# Altium project Udemy_Project.PrjPcb
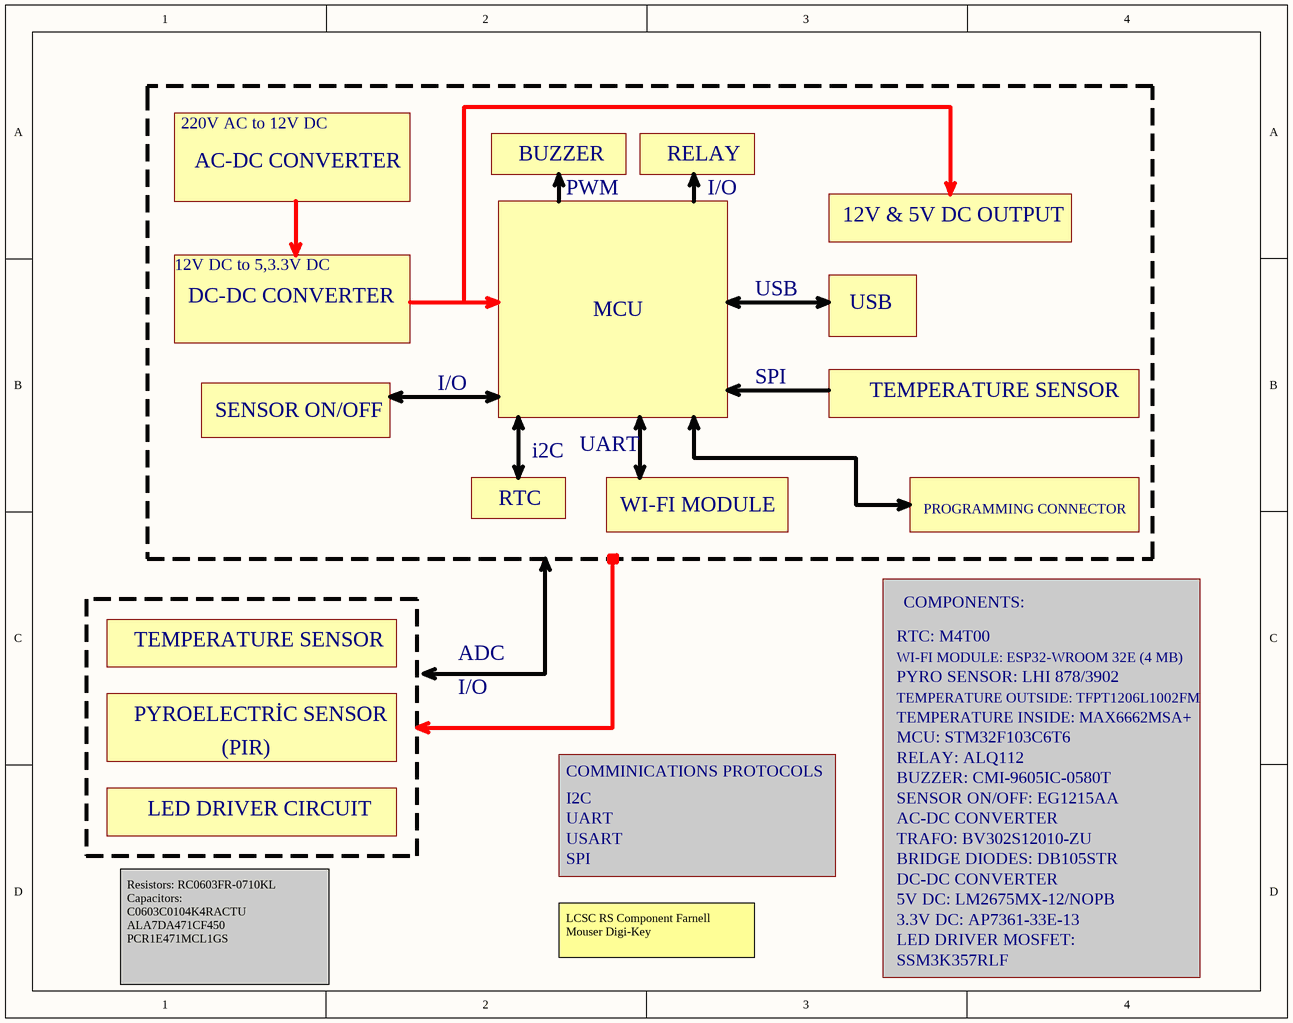
[diagram p0: Block Diagram.SchDoc]
5 sheets, 127 parts. Net scope: global (net labels, ports and power ports of the same name join across sheets).
Board file: Udemy_Project.PcbDoc
Sheets:
  Cover.SchDoc
  Block Diagram.SchDoc
  Power Management.SchDoc
  Microcontroller.SchDoc
  Sensor Board.SchDoc

## Sheet Cover.SchDoc: Wireless Security Dedector
size A; SheetNumber: 1; SheetTotal: 5

## Sheet Block Diagram.SchDoc
size A; Engineer: Cengizhan Kahraman; SheetNumber: 2; SheetTotal: 5

### Notes on the sheet
- 220V AC to 12V DC
- BUZZER
- RELAY
- AC-DC CONVERTER
- PWM
- I/O
- 12V & 5V DC OUTPUT
- 12V DC to 5,3.3V DC
- USB
- DC-DC CONVERTER
- MCU
- SENSOR ON/OFF
- SPI
- TEMPERATURE SENSOR
- RTC
- i2C
- UART
- WI-FI MODULE
- PROGRAMMING CONNECTOR
- RTC: M4T00
- COMPONENTS:
- ADC
- WI-FI MODULE: ESP32-WROOM 32E (4 MB)
- PYRO SENSOR: LHI 878/3902
- TEMPERATURE OUTSIDE: TFPT1206L1002FM
- PYROELECTRİC SENSOR
- (PIR)
- COMMINICATIONS PROTOCOLS
- TEMPERATURE INSIDE: MAX6662MSA+
- MCU: STM32F103C6T6
- RELAY: ALQ112
- LED DRIVER CIRCUIT
- I2C
- BUZZER: CMI-9605IC-0580T
- SENSOR ON/OFF: EG1215AA
- USART
- TRAFO: BV302S12010-ZU
- BRIDGE DIODES: DB105STR
- 5V DC: LM2675MX-12/NOPB
- LCSC RS Component Farnell Mouser Digi-Key
- LED DRIVER MOSFET:
- SSM3K357RLF
- 3.3V DC: AP7361-33E-13
- Resistors: RC0603FR-0710KL
  Capacitors:
  C0603C0104K4RACTU
  ALA7DA471CF450
  PCR1E471MCL1GS

## Sheet Power Management.SchDoc
size A3; SheetNumber: 3; SheetTotal: 5
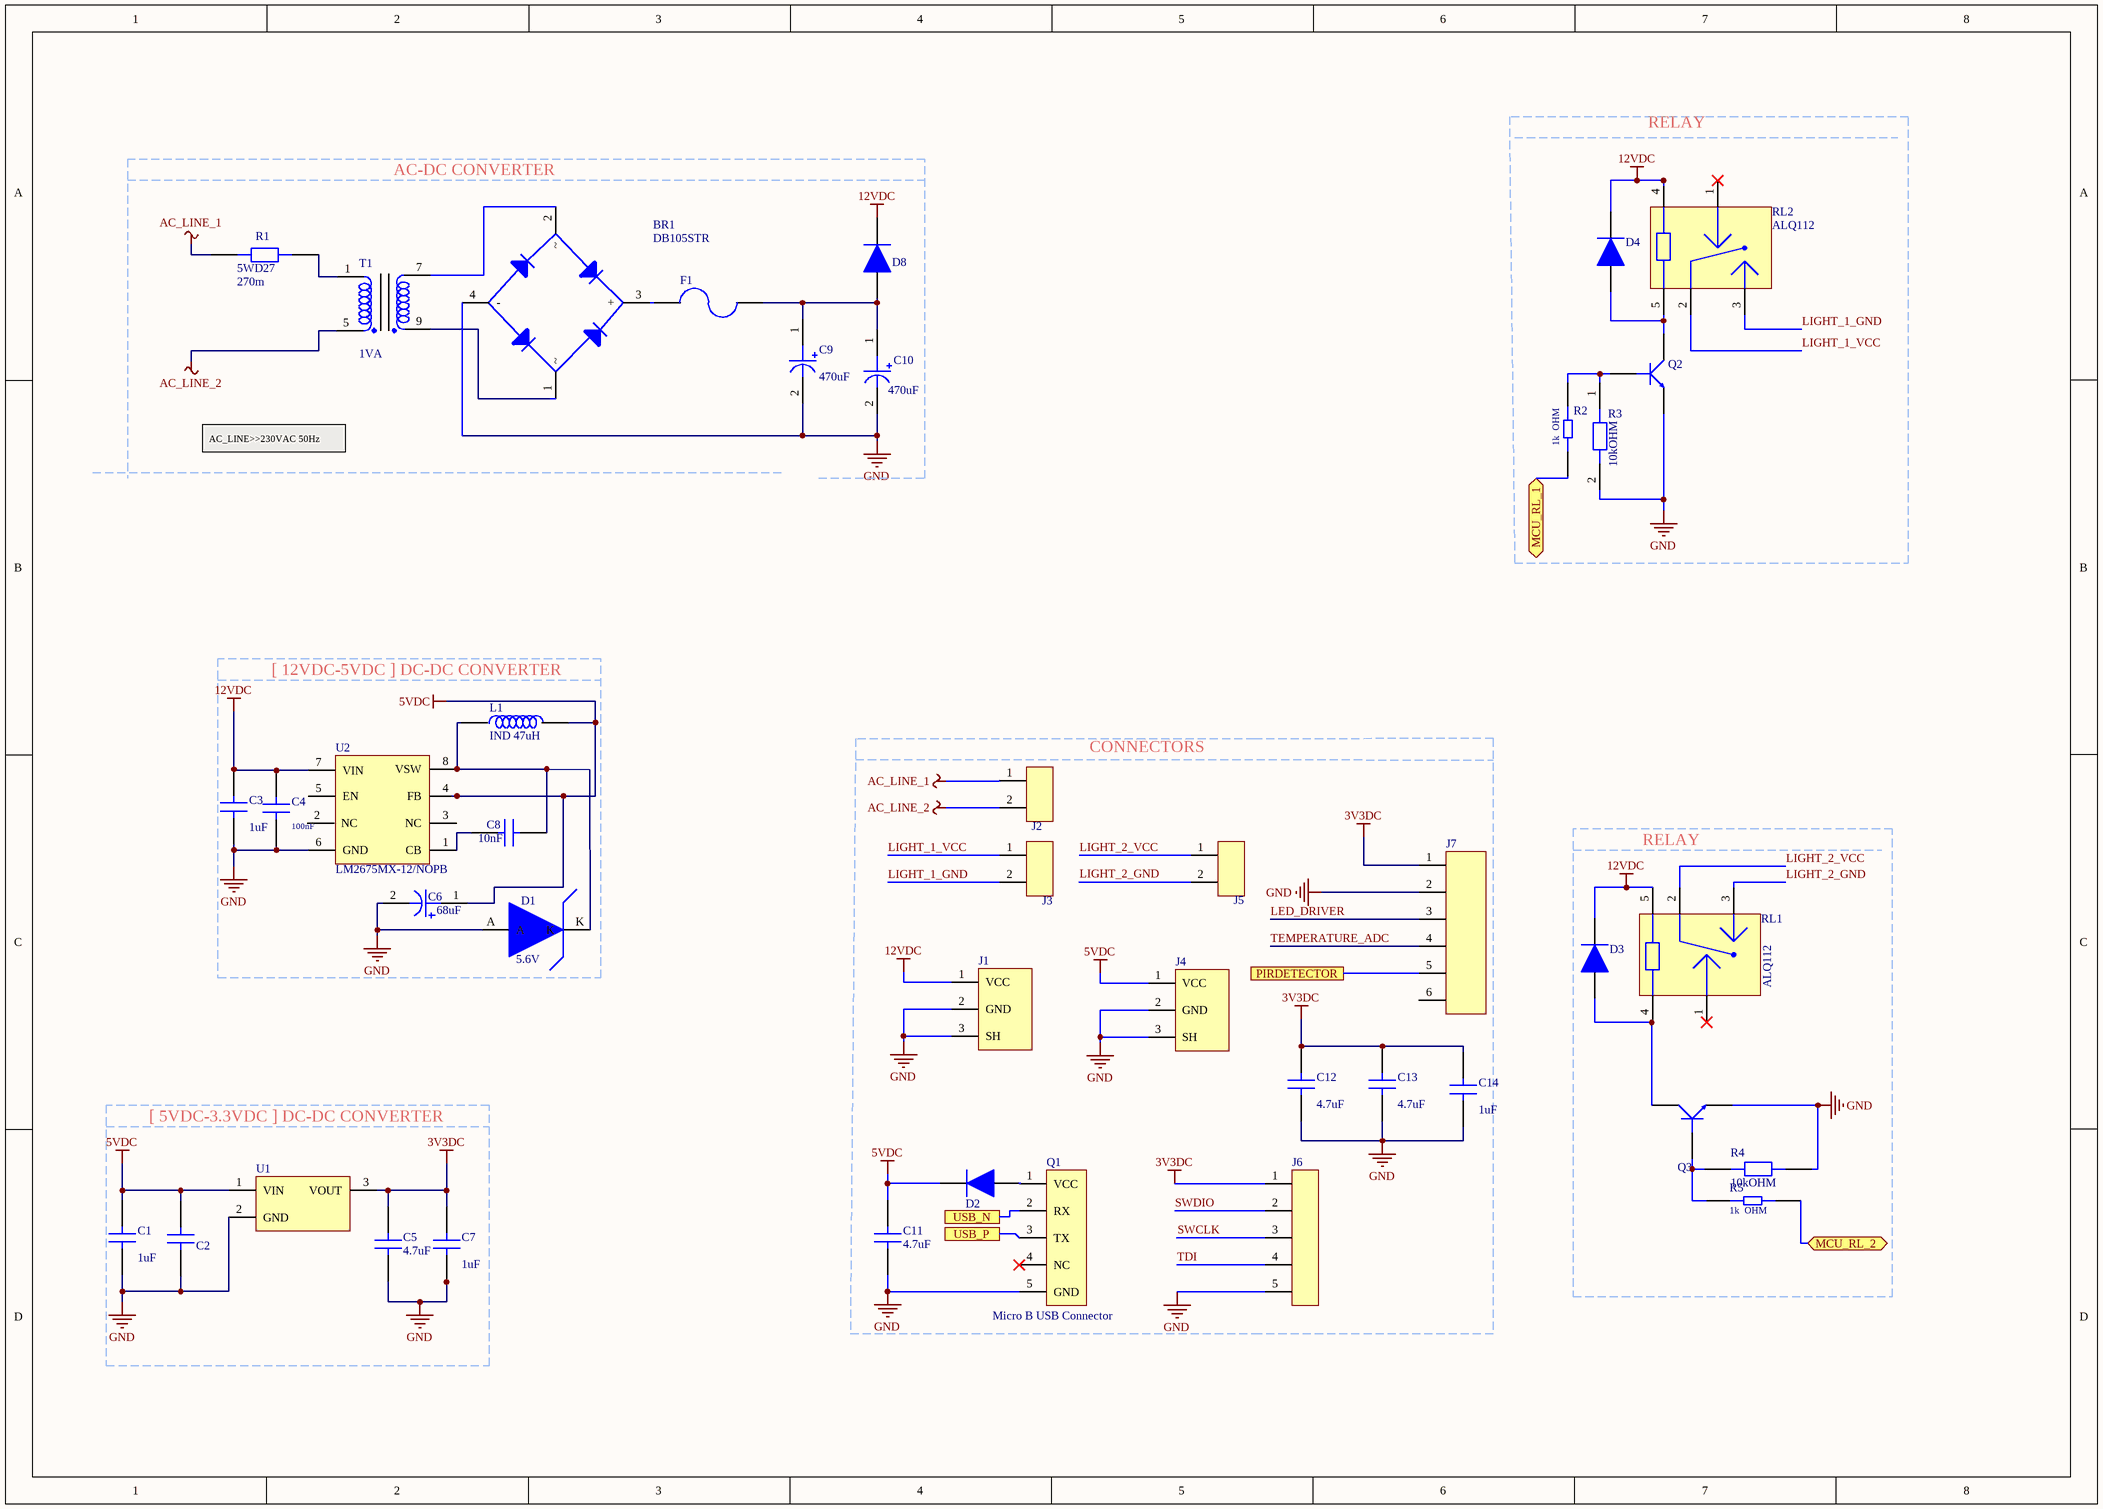
[diagram p1: Power Management.SchDoc]

### Parts
BR1  DB105STR  [DB1]
C1  Cap: 1uF  [CAP 0805]  (hidden comment: CAP CER 1uF)
C2  CAP CER 100nF 0603  [CAP_0603]  (value not drawn)
C3  Cap: 1uF  [CAP 0805]  (hidden comment: CAP CER 1uF)
C4  Capacitance: 100nF  [CAP 0805]  (hidden comment: CAP CER 100nF 0805)
C5  Cap: 4.7uF  [CAP 0805]  (hidden comment: CAP CER 4.7uF 0805)
C6  Capacitance: 68uF  [CAP EEVSERIES]  (hidden comment: CAP ALU 68uF)
C7  Cap: 1uF  [CAP 0805]  (hidden comment: CAP CER 1uF)
C8  Capacitance: 10nF  [CAP_0603]  (hidden comment: CAP CER 10nF 0603)
C9  Cap: 470uF  [CAP_RADIAL_D10_P5]  (hidden comment: ESH477M050AH4AA)
C10  Cap: 470uF  [CAP_RADIAL_D10_P5]  (hidden comment: ESH477M050AH4AA)
C11  Cap: 4.7uF  [CAP 0805]  (hidden comment: CAP CER 4.7uF 0805)
C12  Cap: 4.7uF  [CAP 0805]  (hidden comment: CAP CER 4.7uF 0805)
C13  Cap: 4.7uF  [CAP 0805]  (hidden comment: CAP CER 4.7uF 0805)
C14  Cap: 1uF  [CAP 0805]  (hidden comment: CAP CER 1uF)
D1  Zener Voltage: 5.6V  [SZM]  (hidden comment: SZMMSZ52)
D2  1N4148WS  [SOD323F]  (value not drawn)
D3  1N4148WS  [SOD323F]  (value not drawn)
D4  1N4148WS  [SOD323F]  (value not drawn)
D8  1N4148WS  [SOD323F]  (value not drawn)
F1  FUSE 3413.0216.22  [FUSE 3413.0216.22]  (value not drawn)
J1  PJ-037AH-SMT-TR  [JACk]  (value not drawn)
J2  TBP01R1-508-02BE  [TBP01R1-508]  (value not drawn)
J3  TBP01R1-508-02BE  [TBP01R1-508]  (value not drawn)
J4  PJ-037AH-SMT-TR  [JACk]  (value not drawn)
J5  TBP01R1-508-02BE  [TBP01R1-508]  (value not drawn)
J6  SMH-105-02-L-S  [PINHEADER1X5_RA]  (value not drawn)
J7  64800611622_conn_6pin  [64800611622]  (value not drawn)
L1  IND 47uH  [IND_1212]
Q1  Micro B USB Connector  [MICRO_B_USB]
Q2  MMBT3904-7-F  [SOT-23F]  (value not drawn)
Q3  MMBT3904-7-F  [SOT-23F]  (value not drawn)
R1  5WD27  Resistance: 270m  [RES_AXIAL_W]
R2  Reisitance: 1k  OHM  [RES_0603]  (hidden comment: RES 1K OHM 0603)
R3  Resistance: 10kOHM  [RES_0603]  (hidden comment: RES 10K OHM 0603)
R4  Resistance: 10kOHM  [RES_0603]  (hidden comment: RES 10K OHM 0603)
R5  Reisitance: 1k  OHM  [RES_0603]  (hidden comment: RES 1K OHM 0603)
RL1  ALQ112  [ALQ112]
RL2  ALQ112  [ALQ112]
T1  Rated Power: 1VA  [BV302S]  (hidden comment: BV302S12010-ZU)
U1  AP7361-33E-13  [SOT223]  (value not drawn)
U2  LM2675MX-12/NOPB  [SOIC8]

### Blocks framed on the sheet
RELAY: D4 Q2 R2 R3 RL2
[ 12VDC-5VDC ] DC-DC CONVERTER: C3 C4 C6 C8 D1 L1 U2
CONNECTORS: C11-C14 D2 J1-J7 Q1
RELAY: D3 Q3 R4 R5 RL1
[ 5VDC-3.3VDC ] DC-DC CONVERTER: C1 C2 C5 C7 U1

### Ports
MCU_RL_1 (bidir, see Microcontroller[6800,6750]), MCU_RL_2 (bidir, see Microcontroller[6809.449,6650]), PIRDETECTOR (see Microcontroller[6600,6350]), USB_N (see Microcontroller[7000,8850]), USB_P (see Microcontroller[6900,7750])

### Nets
3V3DC: C5.1 C7.2 C12.2 C13.2 C14.2 J6.1 J7.1 U1.3(VOUT)
5VDC: C1.2 C2.2 C6.1 C11.1 D2.1 J4.1(VCC) L1.2 U1.1(VIN) U2.4(FB)
12VDC: C3.1 C4.2 D3.1 D4.1 D8.1 J1.1(VCC) RL1.5 RL2.4 U2.7(VIN)
AC_LINE_1: J2.1 R1.1
AC_LINE_2: J2.2 T1.5
GND: BR1.4(-) C1.1 C2.1 C3.2 C4.1 C5.2 C6.2 C7.1 C9.2 C10.2 C11.2 C12.1 C13.1 C14.1 D1.A J1.2(GND) J1.3(SH) J4.2(GND) J4.3(SH) J6.5 J7.2 Q1.5(GND) Q2.2(E) Q3.2(E) R3.2 R4.1 U1.2(GND) U2.6(GND)
LED_DRIVER: J7.3
LIGHT_1_GND: J3.2 RL2.3
LIGHT_1_VCC: J3.1 RL2.2
LIGHT_2_GND: J5.2 RL1.3
LIGHT_2_VCC: J5.1 RL1.2
SWCLK: J6.3
SWDIO: J6.2
TDI: J6.4
TEMPERATURE_ADC: J7.4
USB_N: Q1.2(RX) ; port USB_N
USB_P: Q1.3(TX) ; port USB_P
NetBR1_1: BR1.1 T1.9
NetBR1_2: BR1.2 T1.7
NetBR1_3: BR1.3(+) F1.1
NetC8_1: C8.1 U2.1(CB)
NetC8_2: C8.2 D1.K L1.1 U2.8(VSW)
NetC9_1: C9.1 C10.1 D8.2 F1.2
NetD2_2: D2.2 Q1.1(VCC)
NetD3_2: D3.2 Q3.3(C) RL1.4
NetD4_2: D4.2 Q2.3(C) RL2.5
NetJ7_5: J7.5 ; port PIRDETECTOR
NetQ2_1: Q2.1(B) R2.2 R3.1
NetQ3_1: Q3.1(B) R4.2 R5.2
NetR1_2: R1.2 T1.1
NetR2_1: R2.1 ; port MCU_RL_1
NetR5_1: R5.1 ; port MCU_RL_2

Not connected (* = marked no-connect by the designer): J7 6; Q1 4(NC)*; RL1 1*; RL2 1*; U2 2(NC) 3(NC) 5(EN)

### Notes on the sheet
- (near BR1) AC-DC CONVERTER
- AC_LINE>>230VAC 50Hz
- Programing
  Connection

### Library data of the parts
BR1 = DB105STR: Bridge Rect 1PHASE 600V 1A Db-s; Manufacturer: SMC; Supplier 1: Future Electronics; Manufacturer Part Number: DB105STR; RoHS: No; Category: Industrial Control; Pricing 1: 1500=0.0744, 4500=0.0716, 15000=0.0686, 30000=0.067, 60000=0.064 (USD); Mount: Surface Mount; Case/Package: SMD/SMT; Min Operating Temperature: -55°C; Max Operating Temperature: 150°C; Packaging: Tape and Reel; Average Rectified Current: 1A; ComponentLink1URL: http://www.smc-diodes.com/propdf/DB101S%20THRU%20DB107S%20N1459%20REV.B.pdf?src-supplier=Digi-Key; ComponentLink1Description: http://www.smc-diodes.com/propdf/DB101S%20THRU%20DB107S%20N1459%20REV.B.pdf?src-supplier=Digi-Key; Supplier Part Number 1: 5119461; Case/Packag: *
C4 = CAP CER 100nF 0805: Multilayer Ceramic Capacitor, VJ Series, 0.1 - F, - 10%, X7R, 50 V, 0805 [2012 Metric]; Manufacturer: Vishay Vitramon; Manufacturer Part Number: VJ0805Y104KNAAT; Voltage Rating (DC): 50V; Supplier 1: Farnell; RoHS: Yes; Category: Ceramic Capacitors; Pricing 1: 5=0.523, 50=0.312, 250=0.297, 500=0.214, 1500=0.201, 3000=0.17, 15000=0.15, 30000=0.147 (EUR); Mount: Surface Mount; Case/Package: 0805; Case Code (Metric): 2012; Case Code (Imperial): 0805; Min Operating Temperature: -55°C; Max Operating Temperature: 125°C; Tolerance: 10%; Dielectric: X7R; Packaging: Tape and Reel; Termination: SMD/SMT; Series: VJ; Package Quantity: 1; Construction: Flat; Voltage Rating: 50V; Voltage: 50V; Length: 2mm; Width: 0.049inch; Height: 1.45mm; Depth: 1.25mm; Thickness: 0.057inch; Radiation Hardening: No; RoHS Compliant: Yes; Reach SVHC Compliant: Unknown; ComponentLink1URL: https://datasheet.ciiva.com/11785/0900766b8104796c-11785977.pdf?src-supplier=Rs; ComponentLink1Description: https://datasheet.ciiva.com/11785/0900766b8104796c-11785977.pdf?src-supplier=Rs; ComponentLink2URL: https://datasheet.ciiva.com/46417/1805046-46417861.pdf?src-supplier=Element14; ComponentLink2Description: https://datasheet.ciiva.com/46417/1805046-46417861.pdf?src-supplier=Element14; ComponentLink3URL: https://datasheet.ciiva.com/46417/1805046-46417862.pdf?src-supplier=Element14; ComponentLink3Description: https://datasheet.ciiva.com/46417/1805046-46417862.pdf?src-supplier=Element14; ComponentLink4URL: https://datasheet.ciiva.com/148/nonmagneticepoxybond-148471.pdf?src-supplier=Digi-Key; ComponentLink4Description: https://datasheet.ciiva.com/148/nonmagneticepoxybond-148471.pdf?src-supplier=Digi-Key; ComponentLink5URL: https://datasheet.ciiva.com/148/nonmagneticepoxybond-148472.pdf?src-supplier=Digi-Key; ComponentLink5Description: https://datasheet.ciiva.com/148/nonmagneticepoxybond-148472.pdf?src-supplier=Digi-Key; ComponentLink6URL: https://datasheet.ciiva.com/148/nonmagneticepoxybond-148473.pdf?src-supplier=Digi-Key; ComponentLink6Description: https://datasheet.ciiva.com/148/nonmagneticepoxybond-148473.pdf?src-supplier=Digi-Key; Supplier Part Number 1: 2407330
C5 C11-C13 = CAP CER 4.7uF 0805: CAP CER 4.7UF 25V X5R 0805; Manufacturer: Samsung; Manufacturer Part Number: CL21A475KAQNNNE; Supplier 1: Arrow Electronics; RoHS: Yes; Category: Ceramic Capacitors; Stock 1: 906000; Pricing 1: 2000=0.0173, 4000=0.0169, 10000=0.0146, 14000=0.0133, 50000=0.0114, 100000=0.0096, 200000=0.0089 (USD); ComponentLink1URL: https://datasheet.ciiva.com/25798/cl21a475kaqnnne-25798882.pdf?src-supplier=Digi-Key; ComponentLink1Description: https://datasheet.ciiva.com/25798/cl21a475kaqnnne-25798882.pdf?src-supplier=Digi-Key; Supplier Part Number 1: CL21A475KAQNNNE
C9 C10 = ESH477M050AH4AA: Cap, 470UF, 50V, Alu Elec, Radial; Manufacturer: KEMET; Supplier 1: Mouser; Manufacturer Part Number: ESH477M050AH4AA; RoHS: Yes; Stock 1: 3823; Pricing 1: 1=0.57, 10=0.4, 50=0.302, 100=0.263, 1000=0.263, 10000=0.263 (USD); ComponentLink1URL: https://api.kemet.com/component-edge/download/datasheet/ESH477M050AH4AA.pdf?src-supplier=Digi-Key; ComponentLink1Description: https://api.kemet.com/component-edge/download/datasheet/ESH477M050AH4AA.pdf?src-supplier=Digi-Key; ComponentLink2URL: https://datasheet.octopart.com/ESH477M050AH4AA-KEMET-datasheet-130075338.pdf?src-supplier=Newark; ComponentLink2Description: https://datasheet.octopart.com/ESH477M050AH4AA-KEMET-datasheet-130075338.pdf?src-supplier=Newark; Supplier Part Number 1: 80-ESH477M050AH4AA
D1 = SZMMSZ52: Diode Zener Single 16V 5% 500mW Automotive 2-Pin SOD-123 T/R; Manufacturer: ON Semiconductor; Manufacturer Part Number: SZMMSZ5246BT1G; Supplier 1: Arrow Electronics; RoHS: Yes; Category: Zener Diodes; Stock 1: 14410; Pricing 1: 1=0.3412, 10=0.2585, 25=0.2552, 100=0.1485, 250=0.1467, 500=0.0977, 1000=0.0743, 3000=0.0616, 6000=0.0574 (USD); ComponentLink1URL: https://datasheet.ciiva.com/10638/mmsz5221bt1-d-10638284.pdf?src-supplier=Avnet; ComponentLink1Description: https://datasheet.ciiva.com/10638/mmsz5221bt1-d-10638284.pdf?src-supplier=Avnet; ComponentLink2URL: https://datasheet.ciiva.com/900/mmsz5221bt1-d-900242.pdf?src-supplier=Digi-Key; ComponentLink2Description: https://datasheet.ciiva.com/900/mmsz5221bt1-d-900242.pdf?src-supplier=Digi-Key; Supplier Part Number 1: SZMMSZ5246BT1G
D2-D4 D8 = 1N4148WS: VR=75V IF=150mA Trr=4ns P=200mW; Manufacturer: ON Semiconductor / Fairchild; Supplier 1: Future Electronics; Manufacturer Part Number: 1N4148WS; RoHS: Yes; Category: Rectifier Diodes; Stock 1: 423000; Pricing 1: 3000=0.0191, 12000=0.0183, 45000=0.0175, 75000=0.0173, 150000=0.0164 (USD); ComponentLink1URL: https://datasheet.ciiva.com/30479/0900766b810e1cd3-30479206.pdf?src-supplier=Rs; ComponentLink1Description: https://datasheet.ciiva.com/30479/0900766b810e1cd3-30479206.pdf?src-supplier=Rs; ComponentLink2URL: https://datasheet.ciiva.com/8300/1n914bws-8300360.pdf?src-supplier=Avnet; ComponentLink2Description: https://datasheet.ciiva.com/8300/1n914bws-8300360.pdf?src-supplier=Avnet; ComponentLink3URL: https://datasheet.ciiva.com/15208/getdatasheetpartid-127819-15208358.pdf?src-supplier=Verical; ComponentLink3Description: https://datasheet.ciiva.com/15208/getdatasheetpartid-127819-15208358.pdf?src-supplier=Verical; ComponentLink4URL: https://datasheet.ciiva.com/910/1n4148ws-910380.pdf?src-supplier=Digi-Key; ComponentLink4Description: https://datasheet.ciiva.com/910/1n4148ws-910380.pdf?src-supplier=Digi-Key; ComponentLink5URL: https://datasheet.ciiva.com/910/1n4148ws-910381.pdf?src-supplier=Digi-Key; ComponentLink5Description: https://datasheet.ciiva.com/910/1n4148ws-910381.pdf?src-supplier=Digi-Key; ComponentLink6URL: https://datasheet.ciiva.com/910/1n4148ws-910382.pdf?src-supplier=Digi-Key; ComponentLink6Description: https://datasheet.ciiva.com/910/1n4148ws-910382.pdf?src-supplier=Digi-Key; Supplier Part Number 1: 8814485
F1 = FUSE 3413.0216.22: Fuse Chip Fast Acting 1A 32V SMD Solder Pad 1206 Glass T/R VDE/cULus; Manufacturer: Schurter; Supplier 1: Avnet; Manufacturer Part Number: 3413.0216.22; RoHS: Yes; Category: Fuses; Stock 1: 2000; Pricing 1: 1000=0.37339, 2000=0.3654, 4000=0.35496, 6000=0.34713, 8000=0.33408, 10000=0.32625, 100000=0.31842 (USD); ComponentLink1URL: https://datasheet.ciiva.com/301/typ-usi-1206-301440.pdf?src-supplier=Digi-Key; ComponentLink1Description: https://datasheet.ciiva.com/301/typ-usi-1206-301440.pdf?src-supplier=Digi-Key; ComponentLink2URL: https://datasheet.ciiva.com/14102/qousi1206-data-e-14102903.pdf?src-supplier=Distrelec; ComponentLink2Description: https://datasheet.ciiva.com/14102/qousi1206-data-e-14102903.pdf?src-supplier=Distrelec; ComponentLink3URL: https://datasheet.ciiva.com/16316/typ-usi-1206-16316588.pdf?src-supplier=Future+Electronics; ComponentLink3Description: https://datasheet.ciiva.com/16316/typ-usi-1206-16316588.pdf?src-supplier=Future+Electronics; ComponentLink4URL: https://datasheet.ciiva.com/301/typ-usi-1206-301439.pdf?src-supplier=Digi-Key; ComponentLink4Description: https://datasheet.ciiva.com/301/typ-usi-1206-301439.pdf?src-supplier=Digi-Key; ComponentLink5URL: https://datasheet.ciiva.com/301/typ-usi-1206-301441.pdf?src-supplier=Digi-Key; ComponentLink5Description: https://datasheet.ciiva.com/301/typ-usi-1206-301441.pdf?src-supplier=Digi-Key; ComponentLink6URL: https://datasheet.ciiva.com/8264/typ-usi-1206-8264583.pdf?src-supplier=Avnet; ComponentLink6Description: https://datasheet.ciiva.com/8264/typ-usi-1206-8264583.pdf?src-supplier=Avnet; ComponentLink7URL: https://datasheet.ciiva.com/14541/70160006-14541114.pdf?src-supplier=Allied+Electronics; ComponentLink7Description: https://datasheet.ciiva.com/14541/70160006-14541114.pdf?src-supplier=Allied+Electronics; Supplier Part Number 1: 3413.0216.22
J1 J4 = PJ-037AH-SMT-TR: 2.0 x 6.3 mm, 5.0 A, Horizontal, Surface Mount (SMT), Dc Power Jack Connector; Manufacturer: CUI; Number of Conductors: 2; Gender: Male; Shielding: Unshielded; Current Rating: 5A; Voltage Rating: 24V; Insulation Resistance: 100MR; Supplier 1: Mouser; Manufacturer Part Number: PJ-037AH-SMT-TR; RoHS: Yes; Category: Uncategorized; Mount: Surface Mount,Through Hole; Case/Package: SMD/SMT; Color: Black; Contact Material: Copper; Contact Plating: Nickel; Housing Color: Black; Housing Material: Thermoplastic; Min Operating Temperature: -25°C; Max Operating Temperature: 85°C; Orientation: Horizontal; Package Quantity: 200; Termination: Solder; Connector Type: Jack; Contact Gender: Male; Packaging: Tape and Reel; Flammability Rating: UL94 V-0; ComponentLink1URL: http://www.mouser.com/ds/2/670/pj-037ah-smt-516065.pdf?src-supplier=Mouser; ComponentLink1Description: http://www.mouser.com/ds/2/670/pj-037ah-smt-516065.pdf?src-supplier=Mouser; ComponentLink2URL: https://www.cui.com/product/resource/digikeypdf/pj-037ah-smt-tr.pdf?src-supplier=Digi-Key; ComponentLink2Description: https://www.cui.com/product/resource/digikeypdf/pj-037ah-smt-tr.pdf?src-supplier=Digi-Key; ComponentLink3URL: http://www.cui.com/product/resource/digikeypdf/pj-037ah-smt.pdf?src-supplier=Digi-Key; ComponentLink3Description: http://www.cui.com/product/resource/digikeypdf/pj-037ah-smt.pdf?src-supplier=Digi-Key; Supplier Part Number 1: 490-PJ-037AH-SMT-TR
L1 = IND 47uH: Power Inductor, Aec-Q200, 47Uh, 0.39A Rohs Compliant: Yes |Wurth Elektronik 78438335470; Manufacturer: Wurth Electronics; Core Material: Ferrite; Current Rating: 390mA; Saturation Current: 1.18A; Shielding: Shielded; DC Resistance (DCR): 2.3R; Self Resonant Frequency: 8MHz; Test Frequency: 100kHz; Tolerance: 30%; Supplier 1: Farnell; Manufacturer Part Number: 78438335470; RoHS: Yes; Category: Fixed Inductors; Stock 1: 1175; Pricing 1: 1=1.76, 50=1.67, 100=1.6, 250=1.52, 500=1.41, 1000=1.38, 5000=1.35, 10000=1.33 (EUR); Mount: Surface Mount; Case/Package: 1212; Case Code (Metric): 3030; Case Code (Imperial): 1212; Min Operating Temperature: -40°C; Max Operating Temperature: 125°C; Packaging: Cut Tape; Inductance: 47uH; Series: WE-MAIA; Length: 0.118inch; Width: 0.118inch; Height - Seated (Max): 0.059inch; Ratings: AEC-Q200; RoHS Compliant: Yes; ComponentLink1URL: https://media.digikey.com/pdf/Data%20Sheets/Wurth%20Electronics%20PDFs/Q+_Products_Flyer.pdf?src-supplier=Digi-Key; ComponentLink1Description: https://media.digikey.com/pdf/Data%20Sheets/Wurth%20Electronics%20PDFs/Q+_Products_Flyer.pdf?src-supplier=Digi-Key; Supplier Part Number 1: 3517060
T1 = BV302S12010-ZU: Primary Voltage: 230V; Secondary Voltage: 12V; Operating Frequency: 50-60 Hz
U1 = AP7361-33E-13: AP7361 Series 3.3 V 1 A Low SMT Dropout Fixed-Mode Regulator - SOT-223; Manufacturer: Diodes; Supplier 1: Future Electronics; Manufacturer Part Number: AP7361-33E-13; RoHS: Yes; Category: Voltage Regulators - Linear; Stock 1: 15000; Pricing 1: 2500=0.17, 7500=0.166, 12500=0.163, 50000=0.158, 75000=0.154 (USD); ComponentLink1URL: https://datasheet.ciiva.com/26926/getdatasheetpartid-670786-26926141.pdf?src-supplier=Verical; ComponentLink1Description: https://datasheet.ciiva.com/26926/getdatasheetpartid-670786-26926141.pdf?src-supplier=Verical; ComponentLink2URL: https://datasheet.ciiva.com/25651/ap7361-25651049.pdf?src-supplier=Digi-Key; ComponentLink2Description: https://datasheet.ciiva.com/25651/ap7361-25651049.pdf?src-supplier=Digi-Key; ComponentLink3URL: https://datasheet.ciiva.com/29568/ap7361-29568378.pdf?src-supplier=Digi-Key; ComponentLink3Description: https://datasheet.ciiva.com/29568/ap7361-29568378.pdf?src-supplier=Digi-Key; ComponentLink4URL: https://datasheet.ciiva.com/29568/ap7361-29568379.pdf?src-supplier=Digi-Key; ComponentLink4Description: https://datasheet.ciiva.com/29568/ap7361-29568379.pdf?src-supplier=Digi-Key; Supplier Part Number 1: 4058800; Case/Package: SOT223
U2 = LM2675MX-12/NOPB: SIMPLE SWITCHER® 6.5V to 40V, 1A Low Component Count Step-Down Regulator 8-SOIC -40 to 125; Manufacturer: TI National Semiconductor; Supplier 1: Digi-Key; Manufacturer Part Number: LM2675MX-12/NOPB; RoHS: Yes; Category: Voltage Regulators - Switching; Pricing 1: 1=4.85, 10=4.356, 25=4.1184, 100=3.5693, 250=3.38624, 500=3.03846, 1000=2.56256 (USD); ComponentLink1URL: https://datasheet.ciiva.com/41457/001013881-da-01-en-ic-reg-buck-lm2675mx-12-nopb-soic-8-tid-41457896.pdf?src-supplier=Conrad; ComponentLink1Description: https://datasheet.ciiva.com/41457/001013881-da-01-en-ic-reg-buck-lm2675mx-12-nopb-soic-8-tid-41457896.pdf?src-supplier=Conrad; ComponentLink2URL: https://datasheet.ciiva.com/3220/lm2675-3220840.pdf?src-supplier=Avnet; ComponentLink2Description: https://datasheet.ciiva.com/3220/lm2675-3220840.pdf?src-supplier=Avnet; Supplier Part Number 1: 296-35410-1-ND
C2 = CAP CER 100nF 0603: Case/Package: 0603; Parameter 1: *
RL1 RL2 = ALQ112: Case/Package: ALQ112

## Sheet Microcontroller.SchDoc
size A3; SheetNumber: 4; SheetTotal: 5
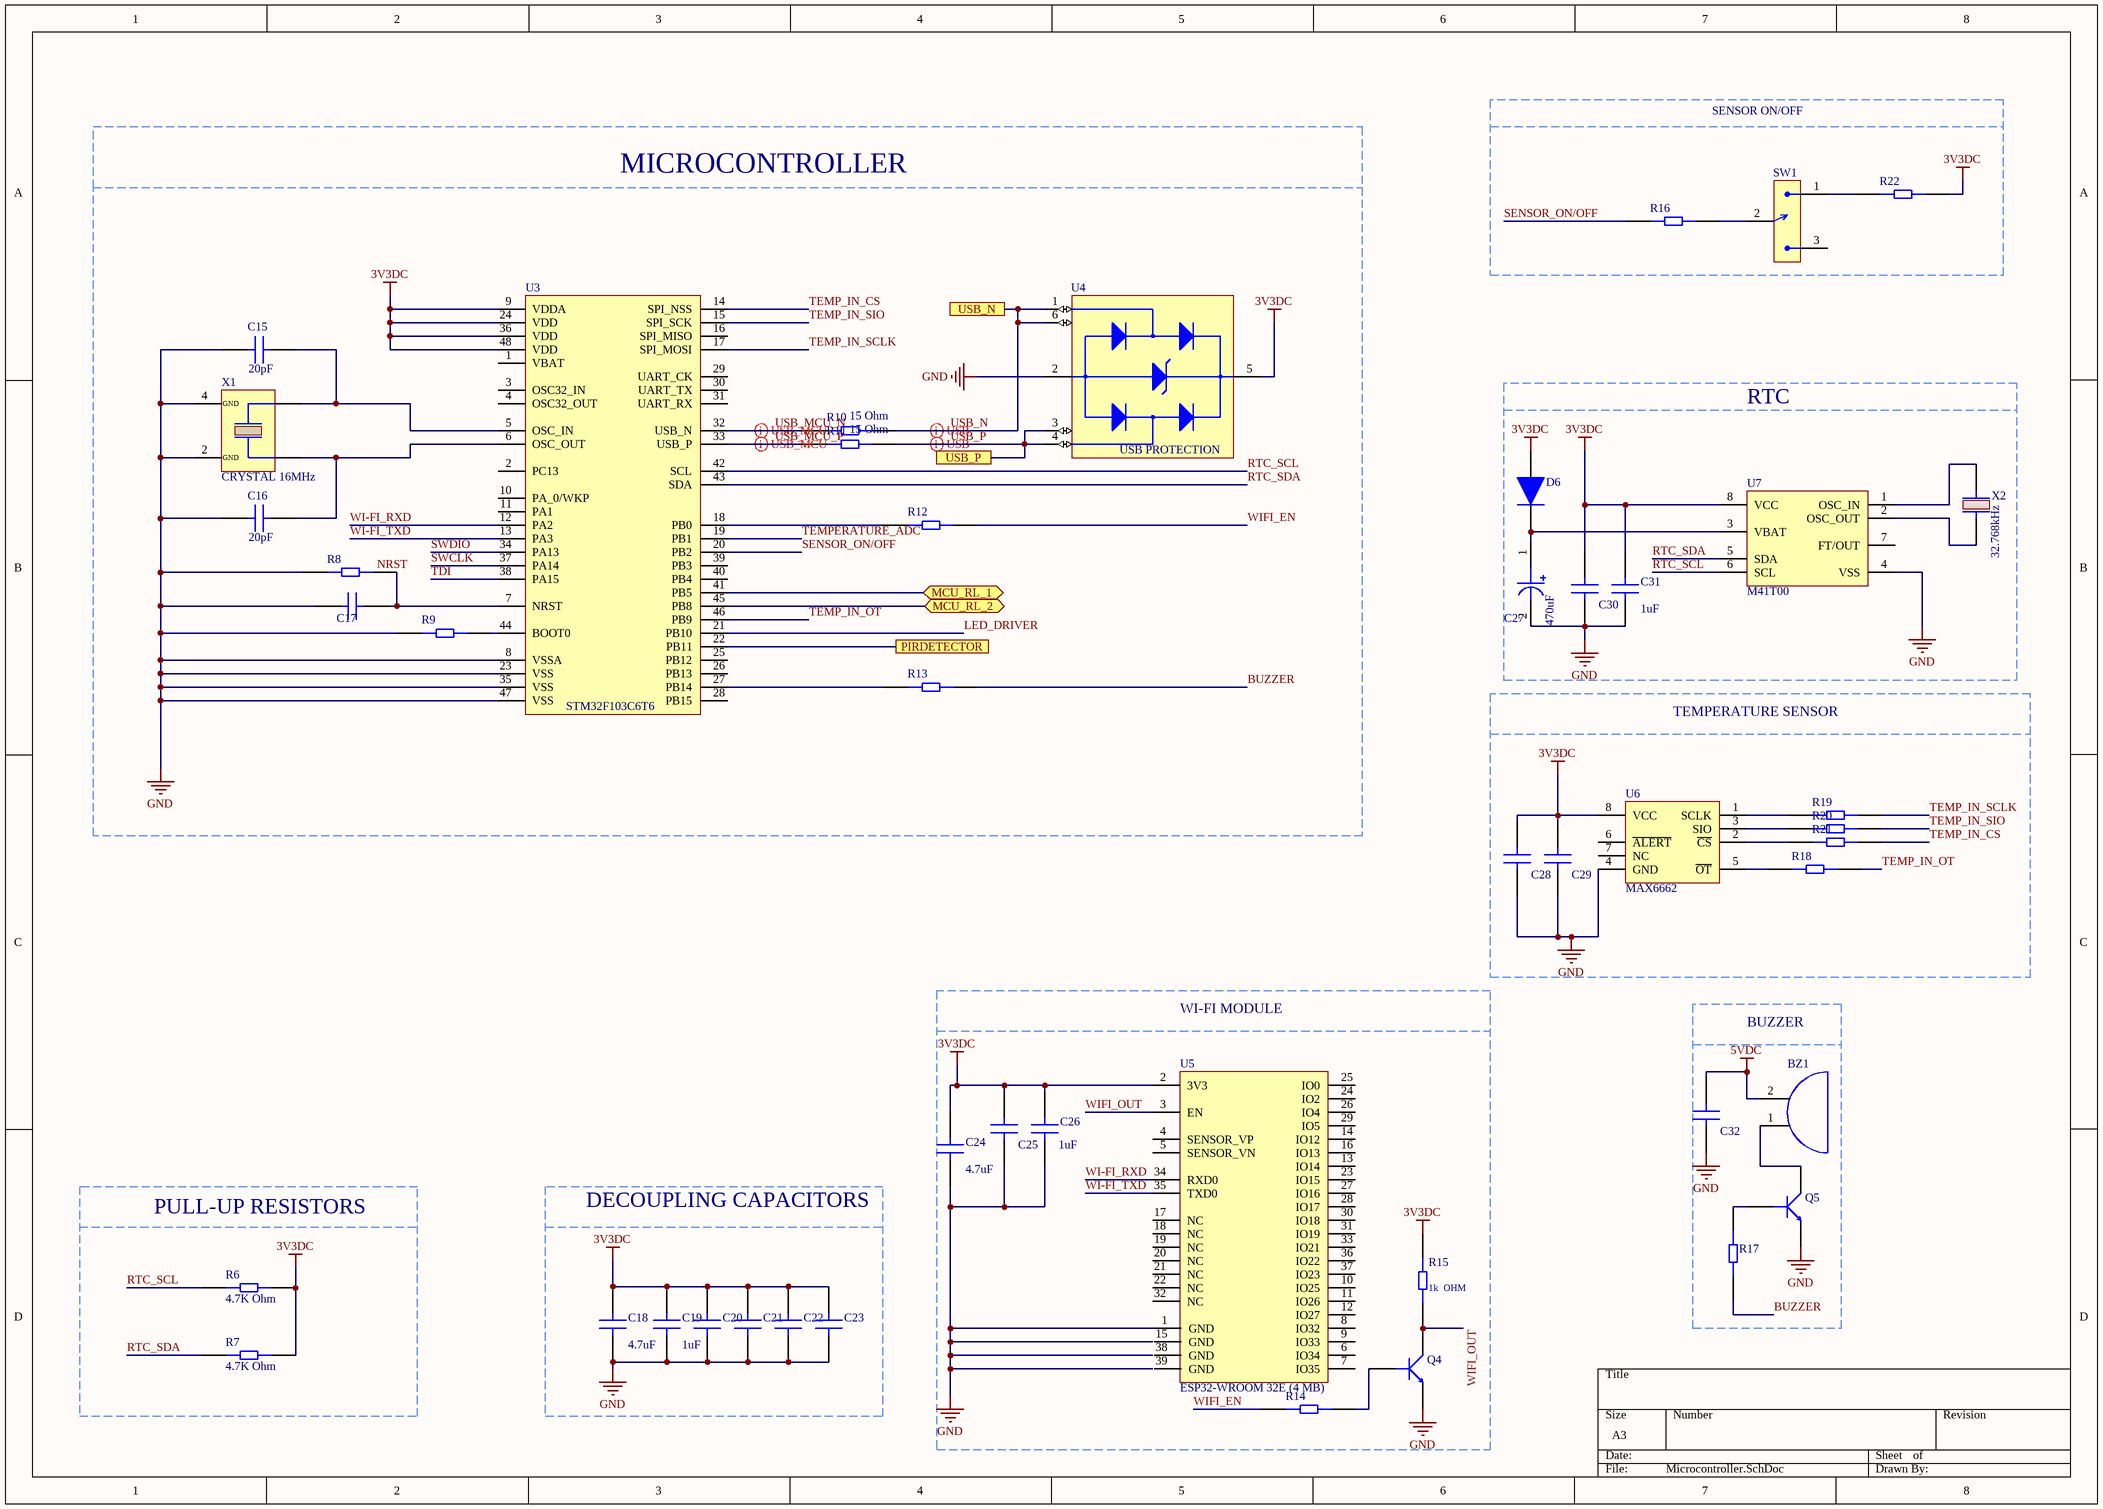
[diagram p2: Microcontroller.SchDoc]

### Parts
(Parts that share a designator on the sheet are numbered #1, #2 ... from top to bottom, then left to right.)
BZ1  CMI-9605IC-0580T  [CMI-9605IC]  (value not drawn)
C15  Cap: 20pF  [CAP_0603]  (hidden comment: CAP CER 20pF 0603)
C16  Cap: 20pF  [CAP_0603]  (hidden comment: CAP CER 20pF 0603)
C17  CAP CER 100nF 0603  [CAP_0603]  (value not drawn)
C18  Cap: 4.7uF  [CAP 0805]  (hidden comment: CAP CER 4.7uF 0805)
C19  Cap: 1uF  [CAP 0805]  (hidden comment: CAP CER 1uF)
C20  CAP CER 100nF 0603  [CAP_0603]  (value not drawn)
C21  CAP CER 100nF 0603  [CAP_0603]  (value not drawn)
C22  CAP CER 100nF 0603  [CAP_0603]  (value not drawn)
C23  CAP CER 100nF 0603  [CAP_0603]  (value not drawn)
C24  Cap: 4.7uF  [CAP 0805]  (hidden comment: CAP CER 4.7uF 0805)
C25  CAP CER 100nF 0603  [CAP_0603]  (value not drawn)
C26  Cap: 1uF  [CAP 0805]  (hidden comment: CAP CER 1uF)
C27  Cap: 470uF  [CAP_RADIAL_D10_P5]  (hidden comment: ESH477M050AH4AA)
C28  CAP CER 100nF 0603  [CAP_0603]  (value not drawn)
C29  CAP CER 100nF 0603  [CAP_0603]  (value not drawn)
C30  CAP CER 100nF 0603  [CAP_0603]  (value not drawn)
C31  Cap: 1uF  [CAP 0805]  (hidden comment: CAP CER 1uF)
C32#1  CAP CER 100nF 0603  [CAP_0603]  (value not drawn)
D6#1  1N4148WS  [SOD323F]  (value not drawn)
Q4  MMBT3904-7-F  [SOT-23F]  (value not drawn)
Q5  MMBT3904-7-F  [SOT-23F]  (value not drawn)
R6  Resistance: 4.7K Ohm  [RES_0603]  (hidden comment: RES 4.7K OHM 0603)
R7  Resistance: 4.7K Ohm  [RES_0603]  (hidden comment: RES 4.7K OHM 0603)
R8  RES 100 OHM 0603  [RES_0603]  (value not drawn)
R9  RES 100 OHM 0603  [RES_0603]  (value not drawn)
R10  Resistance: 15 Ohm  (hidden comment: RES 15 OHM 0603)
R11  Resistance: 15 Ohm  (hidden comment: RES 15 OHM 0603)
R12  RES 100 OHM 0603  [RES_0603]  (value not drawn)
R13  RES 100 OHM 0603  [RES_0603]  (value not drawn)
R14  RES 100 OHM 0603  [RES_0603]  (value not drawn)
R15  Reisitance: 1k  OHM  [RES_0603]  (hidden comment: RES 1K OHM 0603)
R16  RES 100 OHM 0603  [RES_0603]  (value not drawn)
R17  RES 100 OHM 0603  [RES_0603]  (value not drawn)
R18  RES 100 OHM 0603  [RES_0603]  (value not drawn)
R19  RES 100 OHM 0603  [RES_0603]  (value not drawn)
R20  RES 100 OHM 0603  [RES_0603]  (value not drawn)
R21  RES 100 OHM 0603  [RES_0603]  (value not drawn)
R22  RES 100 OHM 0603  [RES_0603]  (value not drawn)
SW1  EG1215AA  [EG121]  (value not drawn)
U3  STM32F103C6T6  [LQFP-48]
U4  USB PROTECTION  [SOT23-6L]
U5  ESP32-WROOM 32E (4 MB)  [ESP32-32E]
U6  MAX6662  [SOIC8]
U7  M41T00  [SOIC8]
X1  CRYSTAL 16MHz  [ECS]
X2  FREQ: 32.768kHz  [AB505]  (hidden comment: CRYSTAL 32768kHZ)

### Blocks framed on the sheet
SENSOR ON/OFF: R16 R22 SW1
MICROCONTROLLER: C15-C17 R8-R13 U3 U4 X1
RTC: C27 C30 C31 D6#1 U7 X2
TEMPERATURE SENSOR: C28 C29 R18-R21 U6
WI-FI MODULE: C24-C26 Q4 R14 R15 U5
BUZZER: BZ1 C32#1 Q5 R17

### Ports
MCU_RL_1 (bidir, see Power Management[288,178]), MCU_RL_2 (bidir, see Power Management[339.076,49.022]), PIRDETECTOR (see Power Management[234.442,99.822]), USB_N (see Power Management[176.84,54]), USB_P (see Power Management[176.784,50.8])

### Nets
3V3DC: C18.2 C19.2 C20.2 C21.2 C22.2 C23.2 C24.2 C25.2 C26.1 C28.2 C29.2 C30.2 C31.1 D6#1.2 R6.2 R7.2 R15.2 R22.2 U3.9(VDDA) U3.24(VDD) U3.36(VDD) U3.48(VDD) U4.5(VBUS) U5.2(3V3) U6.8(VCC) U7.8(VCC)
5VDC: BZ1.2 C32#1.2
GND: C15.2 C16.2 C17.2 C18.1 C19.1 C20.1 C21.1 C22.1 C23.1 C24.1 C25.1 C26.2 C27.2 C28.1 C29.1 C30.1 C31.2 C32#1.1 Q4.2(E) Q5.2(E) R8.1 R9.1 U3.8(VSSA) U3.23(VSS) U3.35(VSS) U3.47(VSS) U4.2(GND) U5.1(GND) U6.4(GND) U7.4(VSS) X1.2(GND) X1.4(GND)
BUZZER: R13.2 R17.1
LED_DRIVER: U3.21(PB10)
RTC_SCL: R6.1 U3.42(SCL) U7.6(SCL)
RTC_SDA: R7.1 U3.43(SDA) U7.5(SDA)
SENSOR_ON/OFF: R16.1 U3.20(PB2)
SWCLK: U3.37(PA14)
SWDIO: U3.34(PA13)
TDI: U3.38(PA15)
TEMP_IN_CS: R21.2 U3.14(SPI_NSS)
TEMP_IN_OT: R18.2 U3.46(PB9)
TEMP_IN_SCLK: R19.2 U3.17(SPI_MOSI)
TEMP_IN_SIO: R20.2 U3.15(SPI_SCK)
TEMPERATURE_ADC: U3.19(PB1)
USB_MCU_N: R10.1 U3.32(USB_N)
USB_MCU_P: R11.1 U3.33(USB_P)
USB_N: R10.2 U4.1(I/O1) U4.6(I/O1) ; port USB_N
USB_P: R11.2 U4.3(I/O2) U4.4(I/O2) ; port USB_P
WI-FI_RXD: U3.12(PA2) U5.34(RXD0)
WI-FI_TXD: U3.13(PA3) U5.35(TXD0)
WIFI_EN: R12.2 R14.1
WIFI_OUT: Q4.3(C) R15.1 U5.3(EN)
NetBZ1_1: BZ1.1 Q5.3(C)
NetC15_1: C15.1 U3.5(OSC_IN) X1.3
NetC16_1: C16.1 U3.6(OSC_OUT) X1.1
NetC17_1: C17.1 R8.2 U3.7(NRST)
NetC27_1: C27.1 D6#1.1 U7.3(VBAT)
NetJ7_5: U3.22(PB11) ; port PIRDETECTOR
NetQ4_1: Q4.1(B) R14.2
NetQ5_1: Q5.1(B) R17.2
NetR2_1: U3.41(PB5) ; port MCU_RL_1
NetR5_1: U3.45(PB8) ; port MCU_RL_2
NetR9_2: R9.2 U3.44(BOOT0)
NetR12_1: R12.1 U3.18(PB0)
NetR13_1: R13.1 U3.27(PB14)
NetR16_2: R16.2 SW1.2
NetR18_1: R18.1 U6.5(~{OT})
NetR19_1: R19.1 U6.1(SCLK)
NetR20_1: R20.1 U6.3(SIO)
NetR21_1: R21.1 U6.2(~{CS})
NetR22_1: R22.1 SW1.1
NetU7_1: U7.1(OSC_IN) X2.2
NetU7_2: U7.2(OSC_OUT) X2.1

Not connected (* = marked no-connect by the designer): SW1 3; U3 1(VBAT) 2(PC13) 3(OSC32_IN) 4(OSC32_OUT) 10(PA_0/WKP) 11(PA1) 16(SPI_MISO) 25(PB12) 26(PB13) 28(PB15) 29(UART_CK) 30(UART_TX) 31(UART_RX) 39(PB3) 40(PB4); U5 4(SENSOR_VP) 5(SENSOR_VN) 6(IO34) 7(IO35) 8(IO32) 9(IO33) 10(IO25) 11(IO26) 12(IO27) 13(IO14) 14(IO12) 15(GND) 16(IO13) 17(NC) 18(NC) 19(NC) 20(NC) 21(NC) 22(NC) 23(IO15) 24(IO2) 25(IO0) 26(IO4) 27(IO16) 28(IO17) 29(IO5) 30(IO18) 31(IO19) 32(NC) 33(IO21) 36(IO22) 37(IO23) 38(GND) 39(GND); U6 6(~{ALERT}) 7(NC); U7 7(FT/OUT)

### Layout directives
differential pair: USB_MCU_N, USB_MCU_P, USB_N, USB_P

### Notes on the sheet
- PULL-UP RESISTORS
- DECOUPLING CAPACITORS
- Labels drawn without touching a wire or pin: NRST

### Library data of the parts
BZ1 = CMI-9605IC-0580T: Audio Buzzer Magnetic 3VDC 7VDC 30mA 5VDC 85dB 2600Hz to 2800Hz Through Hole Pin Box; Manufacturer: CUI Devices; Supplier 1: Arrow Electronics; Manufacturer Part Number: CMI-9605IC-0580T; RoHS: No; Category: Audio Products; Stock 1: 1; Pricing 1: 1=1.3577, 10=1.146, 25=1.0571, 50=0.9935, 100=0.9263, 300=0.797, 600=0.7855 (USD); Supplier 2: Arrow Electronics; Stock 2: 1; Pricing 2: 1=1.3577, 10=1.146, 25=1.0571, 50=0.9935, 100=0.9263, 300=0.797, 600=0.7855 (USD); Supplier Part Number 2: CMI-9605IC-0580T; Case/Package: CMI-9605IC
C18 C24 = CAP CER 4.7uF 0805: as C5 on sheet Power Management; Supplier 1: Arrow Electronics; RoHS: Yes; Category: Ceramic Capacitors; Stock 1: 906000; Pricing 1: 2000=0.0173, 4000=0.0169, 10000=0.0146, 14000=0.0133, 50000=0.0114, 100000=0.0096, 200000=0.0089 (USD); ComponentLink1URL: https://datasheet.ciiva.com/25798/cl21a475kaqnnne-25798882.pdf?src-supplier=Digi-Key; ComponentLink1Description: https://datasheet.ciiva.com/25798/cl21a475kaqnnne-25798882.pdf?src-supplier=Digi-Key; Supplier Part Number 1: CL21A475KAQNNNE
C27 = ESH477M050AH4AA: as C9 on sheet Power Management; Supplier 1: Mouser; Manufacturer Part Number: ESH477M050AH4AA; RoHS: Yes; Stock 1: 3823; Pricing 1: 1=0.57, 10=0.4, 50=0.302, 100=0.263, 1000=0.263, 10000=0.263 (USD); ComponentLink1URL: https://api.kemet.com/component-edge/download/datasheet/ESH477M050AH4AA.pdf?src-supplier=Digi-Key; ComponentLink1Description: https://api.kemet.com/component-edge/download/datasheet/ESH477M050AH4AA.pdf?src-supplier=Digi-Key; ComponentLink2URL: https://datasheet.octopart.com/ESH477M050AH4AA-KEMET-datasheet-130075338.pdf?src-supplier=Newark; ComponentLink2Description: https://datasheet.octopart.com/ESH477M050AH4AA-KEMET-datasheet-130075338.pdf?src-supplier=Newark; Supplier Part Number 1: 80-ESH477M050AH4AA
D6#1 = 1N4148WS: as D2 on sheet Power Management; Supplier 1: Future Electronics; Manufacturer Part Number: 1N4148WS; RoHS: Yes; Category: Rectifier Diodes; Stock 1: 423000; Pricing 1: 3000=0.0191, 12000=0.0183, 45000=0.0175, 75000=0.0173, 150000=0.0164 (USD); ComponentLink1URL: https://datasheet.ciiva.com/30479/0900766b810e1cd3-30479206.pdf?src-supplier=Rs; ComponentLink1Description: https://datasheet.ciiva.com/30479/0900766b810e1cd3-30479206.pdf?src-supplier=Rs; ComponentLink2URL: https://datasheet.ciiva.com/8300/1n914bws-8300360.pdf?src-supplier=Avnet; ComponentLink2Description: https://datasheet.ciiva.com/8300/1n914bws-8300360.pdf?src-supplier=Avnet; ComponentLink3URL: https://datasheet.ciiva.com/15208/getdatasheetpartid-127819-15208358.pdf?src-supplier=Verical; ComponentLink3Description: https://datasheet.ciiva.com/15208/getdatasheetpartid-127819-15208358.pdf?src-supplier=Verical; ComponentLink4URL: https://datasheet.ciiva.com/910/1n4148ws-910380.pdf?src-supplier=Digi-Key; ComponentLink4Description: https://datasheet.ciiva.com/910/1n4148ws-910380.pdf?src-supplier=Digi-Key; ComponentLink5URL: https://datasheet.ciiva.com/910/1n4148ws-910381.pdf?src-supplier=Digi-Key; ComponentLink5Description: https://datasheet.ciiva.com/910/1n4148ws-910381.pdf?src-supplier=Digi-Key; ComponentLink6URL: https://datasheet.ciiva.com/910/1n4148ws-910382.pdf?src-supplier=Digi-Key; ComponentLink6Description: https://datasheet.ciiva.com/910/1n4148ws-910382.pdf?src-supplier=Digi-Key; Supplier Part Number 1: 8814485
SW1 = EG1215AA: Slide Switch, SPDT, 0.025A, 24V, SMD; Manufacturer: E-Switch; Mechanical Life: 10000Cycles; Switch Function: On-On; Actuator Type: Standard; Switch Travel: 1.5mm; Operating Force: 150gf; Actuator Length: 1.4mm; Supplier 1: Farnell; Manufacturer Part Number: EG1215AA; RoHS: Yes; Stock 1: 2239; Pricing 1: 1=1.06, 10=0.958, 25=0.831, 50=0.777, 100=0.722 (EUR); Mount: Surface Mount; Min Operating Temperature: -20°C; Max Operating Temperature: 70°C; Throw Configuration: SPDT; Packaging: Cut Tape; Voltage Rating (DC): 24V; Termination: Gull Wing; Electrical Life: 10000Cycles; Series: EG; RoHS Compliant: Yes; ComponentLink1URL: https://media.digikey.com/pdf/Data%20Sheets/E-Switch%20PDFs/EG1215_Series_Ds.pdf?src-supplier=Digi-Key; ComponentLink1Description: https://media.digikey.com/pdf/Data%20Sheets/E-Switch%20PDFs/EG1215_Series_Ds.pdf?src-supplier=Digi-Key; ComponentLink2URL: http://www.farnell.com/datasheets/2645007.pdf?src-supplier=Farnell; ComponentLink2Description: http://www.farnell.com/datasheets/2645007.pdf?src-supplier=Farnell; Supplier Part Number 1: 4050996
U4 = USB PROTECTION: TVS DIODE 5.25VWM 17VC SOT23-6; Manufacturer: STMicroelectronics; Manufacturer Part Number: USBLC6-2SC6; Supplier 1: Mouser; RoHS: Yes; Category: TVS Diodes; Stock 1: 229222; Pricing 1: 1=0.59, 10=0.507, 50=0.507, 100=0.379, 1000=0.23, 10000=0.182 (USD); ComponentLink1URL: https://datasheet.ciiva.com/15143/getdatasheetpartid-148465-15143789.pdf?src-supplier=Verical; ComponentLink1Description: https://datasheet.ciiva.com/15143/getdatasheetpartid-148465-15143789.pdf?src-supplier=Verical; ComponentLink2URL: https://datasheet.ciiva.com/4508/cd00050750-113117-4508433.pdf?src-supplier=Mouser; ComponentLink2Description: https://datasheet.ciiva.com/4508/cd00050750-113117-4508433.pdf?src-supplier=Mouser; ComponentLink3URL: https://datasheet.ciiva.com/1268/1690354-1268384.pdf?src-supplier=Element14; ComponentLink3Description: https://datasheet.ciiva.com/1268/1690354-1268384.pdf?src-supplier=Element14; ComponentLink4URL: https://datasheet.ciiva.com/16200/cd00050750-16200026.pdf?src-supplier=Future+Electronics; ComponentLink4Description: https://datasheet.ciiva.com/16200/cd00050750-16200026.pdf?src-supplier=Future+Electronics; ComponentLink5URL: https://datasheet.ciiva.com/41444/001184109-da-01-en-ic-esd-protecti-usblc6-2sc6-sot-23-6-stm-41444156.pdf?src-supplier=Conrad; ComponentLink5Description: https://datasheet.ciiva.com/41444/001184109-da-01-en-ic-esd-protecti-usblc6-2sc6-sot-23-6-stm-41444156.pdf?src-supplier=Conrad; Supplier Part Number 1: 511-USBLC6-2SC6
U6 = MAX6662: Temp Sensor Digital Serial (3-Wire, SPI) 8-Pin SOIC N Tube; Manufacturer: Maxim; Manufacturer Part Number: MAX6662MSA+; Supplier 1: Mouser; RoHS: Yes; Category: Temperature and Humidity Sensors; Stock 1: 1124; Pricing 1: 1=2.45, 10=2.35, 50=2.35, 100=2.34, 1000=2.2, 10000=1.95 (USD); ComponentLink1URL: https://datasheet.ciiva.com/5299/max6662-89142-5299456.pdf?src-supplier=Mouser; ComponentLink1Description: https://datasheet.ciiva.com/5299/max6662-89142-5299456.pdf?src-supplier=Mouser; ComponentLink2URL: https://datasheet.ciiva.com/3277/max6662-3277979.pdf?src-supplier=Avnet; ComponentLink2Description: https://datasheet.ciiva.com/3277/max6662-3277979.pdf?src-supplier=Avnet; ComponentLink3URL: https://datasheet.ciiva.com/2003/max6662-2003390.pdf?src-supplier=Digi-Key; ComponentLink3Description: https://datasheet.ciiva.com/2003/max6662-2003390.pdf?src-supplier=Digi-Key; Supplier Part Number 1: 700-MAX6662MSA
U7 = M41T00: Real-time Clocks Clock/Calendar I2C, 2-Wire Serial 70uA @ 2V ~ 5.5V SOIC-8_150mil RoHS; Manufacturer: STMicroelectronics; Manufacturer Part Number: M41T00M6F; Supplier 1: Digi-Key; RoHS: Yes; Category: Real Time Clocks; Stock 1: 5505; Pricing 1: 1=3.96, 10=3.556, 25=3.3616, 100=2.9134, 250=2.76404, 500=2.48016, 1000=2.11425 (USD); ComponentLink1URL: https://datasheet.ciiva.com/7630/1837112-7630077.pdf?src-supplier=Element14; ComponentLink1Description: https://datasheet.ciiva.com/7630/1837112-7630077.pdf?src-supplier=Element14; ComponentLink2URL: https://datasheet.ciiva.com/16213/cd00001542-16213654.pdf?src-supplier=Future+Electronics; ComponentLink2Description: https://datasheet.ciiva.com/16213/cd00001542-16213654.pdf?src-supplier=Future+Electronics; ComponentLink3URL: https://datasheet.ciiva.com/41459/001185345-da-01-en-ic-rtc-srl-512kbit-m41t00m6f-soic-8-stm-41459818.pdf?src-supplier=Conrad; ComponentLink3Description: https://datasheet.ciiva.com/41459/001185345-da-01-en-ic-rtc-srl-512kbit-m41t00m6f-soic-8-stm-41459818.pdf?src-supplier=Conrad; Supplier Part Number 1: 497-4697-1-ND
X1 = CRYSTAL 16MHz: Crystal 16MHz ±30ppm (Tol) ±50ppm (Stability) 20pF FUND 50Ohm 4-Pin Mini-SMD T/R; Manufacturer: Abracon; Manufacturer Part Number: ABS05-32.768KHZ-T; Supplier 1: Future Electronics; RoHS: Yes; Category: Crystals; Stock 1: 2890; Pricing 1: 1=0.85, 15=0.75, 75=0.69, 300=0.64, 1500=0.58 (USD); ComponentLink1URL: https://datasheet.ciiva.com/23810/abs05-23810480.pdf?src-supplier=Newark; ComponentLink1Description: https://datasheet.ciiva.com/23810/abs05-23810480.pdf?src-supplier=Newark; ComponentLink2URL: https://datasheet.ciiva.com/6728/abs05-6728949.pdf?src-supplier=Digi-Key; ComponentLink2Description: https://datasheet.ciiva.com/6728/abs05-6728949.pdf?src-supplier=Digi-Key; ComponentLink3URL: https://datasheet.ciiva.com/6728/abs05-6728950.pdf?src-supplier=Digi-Key; ComponentLink3Description: https://datasheet.ciiva.com/6728/abs05-6728950.pdf?src-supplier=Digi-Key; ComponentLink4URL: https://datasheet.ciiva.com/16411/abs05-16411149.pdf?src-supplier=Future+Electronics; ComponentLink4Description: https://datasheet.ciiva.com/16411/abs05-16411149.pdf?src-supplier=Future+Electronics; Supplier Part Number 1: 4097386; Supplier 2: Arrow Electronics; Stock 2: 17; Pricing 2: 1=0.8053, 10=0.7919 (USD); ComponentLink5URL: https://datasheet.ciiva.com/853/ecx-53b-853408.pdf?src-supplier=Digi-Key; ComponentLink5Description: https://datasheet.ciiva.com/853/ecx-53b-853408.pdf?src-supplier=Digi-Key; ComponentLink6URL: https://datasheet.ciiva.com/853/ecx-53b-853407.pdf?src-supplier=Digi-Key; ComponentLink6Description: https://datasheet.ciiva.com/853/ecx-53b-853407.pdf?src-supplier=Digi-Key; ComponentLink7URL: https://datasheet.ciiva.com/853/ecx-53b-853406.pdf?src-supplier=Digi-Key; ComponentLink7Description: https://datasheet.ciiva.com/853/ecx-53b-853406.pdf?src-supplier=Digi-Key; Supplier Part Number 2: ECS-160-20-30B-TR
X2 = CRYSTAL 32768kHZ: Crystal 0.032768MHz ±20ppm (Tol) 12.5pF Flexural 90000Ohm 2-Pin CSMD T/R; Manufacturer: Abracon; Manufacturer Part Number: ABS05-32.768KHZ-T; Supplier 1: Future Electronics; RoHS: Yes; Category: Crystals; Stock 1: 2890; Pricing 1: 1=0.85, 15=0.75, 75=0.69, 300=0.64, 1500=0.58 (USD); ComponentLink1URL: https://datasheet.ciiva.com/23810/abs05-23810480.pdf?src-supplier=Newark; ComponentLink1Description: https://datasheet.ciiva.com/23810/abs05-23810480.pdf?src-supplier=Newark; ComponentLink2URL: https://datasheet.ciiva.com/6728/abs05-6728949.pdf?src-supplier=Digi-Key; ComponentLink2Description: https://datasheet.ciiva.com/6728/abs05-6728949.pdf?src-supplier=Digi-Key; ComponentLink3URL: https://datasheet.ciiva.com/6728/abs05-6728950.pdf?src-supplier=Digi-Key; ComponentLink3Description: https://datasheet.ciiva.com/6728/abs05-6728950.pdf?src-supplier=Digi-Key; ComponentLink4URL: https://datasheet.ciiva.com/16411/abs05-16411149.pdf?src-supplier=Future+Electronics; ComponentLink4Description: https://datasheet.ciiva.com/16411/abs05-16411149.pdf?src-supplier=Future+Electronics; Supplier Part Number 1: 4097386
C17 C20-C23 C25 C28-C30 C32#1 = CAP CER 100nF 0603: Case/Package: 0603

## Sheet Sensor Board.SchDoc
size A3; SheetNumber: 5; SheetTotal: 5
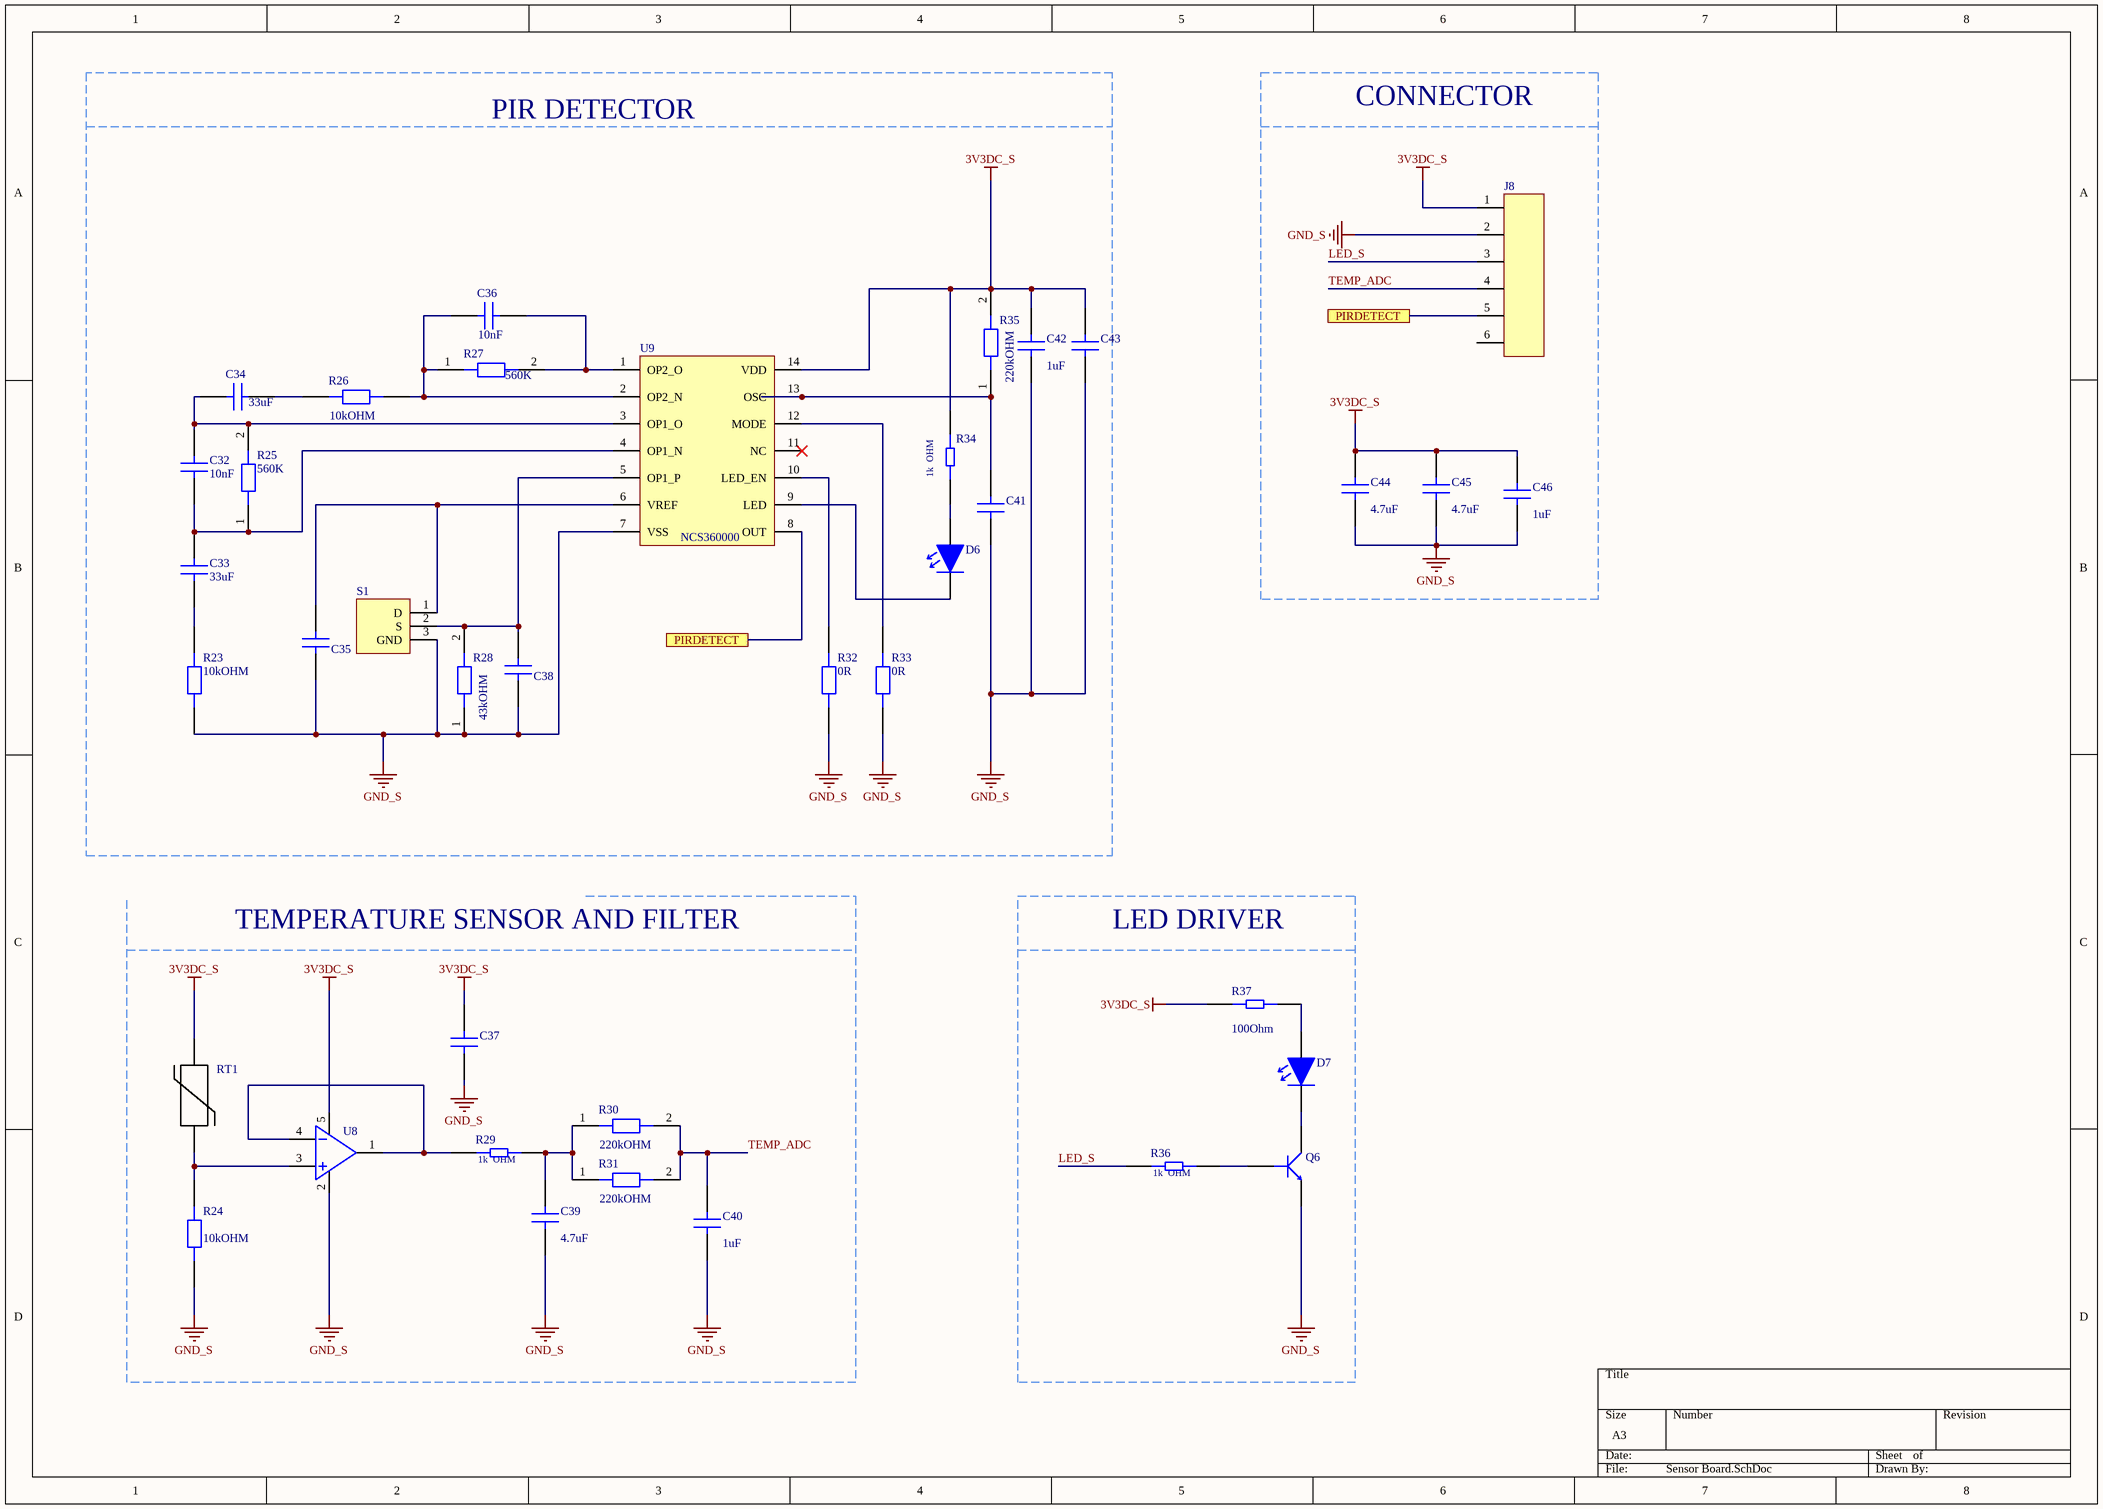
[diagram p3: Sensor Board.SchDoc]

### Parts
(Parts that share a designator on the sheet are numbered #1, #2 ... from top to bottom, then left to right.)
C32#2  Capacitance: 10nF  [CAP_0603]  (hidden comment: CAP CER 10nF 0603)
C33  Capacitance: 33uF  [CAP_1206]  (hidden comment: CAP CER 33uF 1206)
C34  Capacitance: 33uF  [CAP_1206]  (hidden comment: CAP CER 33uF 1206)
C35  CAP CER 100nF 0603  [CAP_0603]  (value not drawn)
C36  Capacitance: 10nF  [CAP_0603]  (hidden comment: CAP CER 10nF 0603)
C37  CAP CER 100nF 0603  [CAP_0603]  (value not drawn)
C38  CAP CER 100nF 0603  [CAP_0603]  (value not drawn)
C39  Cap: 4.7uF  [CAP 0805]  (hidden comment: CAP CER 4.7uF 0805)
C40  Cap: 1uF  [CAP 0805]  (hidden comment: CAP CER 1uF)
C41  CAP CER 100nF 0603  [CAP_0603]  (value not drawn)
C42  Cap: 1uF  [CAP 0805]  (hidden comment: CAP CER 1uF)
C43  CAP CER 100nF 0603  [CAP_0603]  (value not drawn)
C44  Cap: 4.7uF  [CAP 0805]  (hidden comment: CAP CER 4.7uF 0805)
C45  Cap: 4.7uF  [CAP 0805]  (hidden comment: CAP CER 4.7uF 0805)
C46  Cap: 1uF  [CAP 0805]  (hidden comment: CAP CER 1uF)
D6#2  LED GREEN 0805  [LED GREEN 0805]  (value not drawn)
D7  LED RED 0805  [LED RED 0805]  (value not drawn)
J8  64800611622_conn_6pin  [64800611622]  (value not drawn)
Q6  MMBT3904-7-F  [SOT-23F]  (value not drawn)
R23  Resistance: 10kOHM  [RES_0603]  (hidden comment: RES 10K OHM 0603)
R24  Resistance: 10kOHM  [RES_0603]  (hidden comment: RES 10K OHM 0603)
R25  RES: 560K  [RES_0603]  (hidden comment: RES 560K OHM 0603)
R26  Resistance: 10kOHM  [RES_0603]  (hidden comment: RES 10K OHM 0603)
R27  RES: 560K  [RES_0603]  (hidden comment: RES 560K OHM 0603)
R28  Resistance: 43kOHM  [RES_0603]  (hidden comment: RES 43K OHM 0603)
R29  Reisitance: 1k  OHM  [RES_0603]  (hidden comment: RES 1K OHM 0603)
R30  Resistance: 220kOHM  [RES_0603]  (hidden comment: RES 220K OHM 0603)
R31  Resistance: 220kOHM  [RES_0603]  (hidden comment: RES 220K OHM 0603)
R32  Resistance: 0R  [RES_0603]  (hidden comment: RES 0 OHM 0603)
R33  Resistance: 0R  [RES_0603]  (hidden comment: RES 0 OHM 0603)
R34  Reisitance: 1k  OHM  [RES_0603]  (hidden comment: RES 1K OHM 0603)
R35  Resistance: 220kOHM  [RES_0603]  (hidden comment: RES 220K OHM 0603)
R36  Reisitance: 1k  OHM  [RES_0603]  (hidden comment: RES 1K OHM 0603)
R37  Resistance: 100Ohm  [RES_0603]  (hidden comment: RES 100 OHM 0603)
RT1  TFPT 1206L 1002FM  [RES_1206]  (value not drawn)
S1  LHI 878/3902  [LHI 878]  (value not drawn)
U8  OPA314  [SOT23-5]  (value not drawn)
U9  NCS360000  [SOIC14]

### Blocks framed on the sheet
PIR DETECTOR: C32#2 C33-C36 C38 C41-C43 D6#2 R23 R25-R28 R32-R35 S1 U9
CONNECTOR: C44-C46 J8
LED DRIVER: D7 Q6 R36 R37

### Ports
PIRDETECT (see Sensor Board[4900,6400]), PIRDETECT (see Sensor Board[9800,8800])

### Nets
3V3DC_S: C37.2 C42.2 C43.2 C44.2 C45.2 C46.2 J8.1 R34.2 R35.2 R37.1 RT1.2 U8.5 U9.14(VDD)
GND_S: C35.1 C37.1 C38.1 C39.1 C40.1 C41.2 C42.1 C43.1 C44.1 C45.1 C46.1 J8.2 Q6.2(E) R23.1 R24.1 R28.1 R32.1 R33.1 S1.3(GND) U8.2 U9.7(VSS)
LED_S: J8.3 R36.1
TEMP_ADC: C40.2 J8.4 R30.2 R31.2
NetC32#2_1: C32#2.1 C33.2 R25.1 U9.4(OP1_N)
NetC32#2_2: C32#2.2 C34.1 R25.2 U9.3(OP1_O)
NetC33_1: C33.1 R23.2
NetC34_2: C34.2 R26.1
NetC35_2: C35.2 S1.1(D) U9.6(VREF)
NetC36_1: C36.1 R26.2 R27.1 U9.2(OP2_N)
NetC36_2: C36.2 R27.2 U9.1(OP2_O)
NetC38_2: C38.2 R28.2 S1.2(S) U9.5(OP1_P)
NetC39_2: C39.2 R29.2 R30.1 R31.1
NetC41_1: C41.1 R35.1 U9.13(OSC)
NetD6#2_1: D6#2.1 U9.9(LED)
NetD6#2_2: D6#2.2 R34.1
NetD7_1: D7.1 Q6.3(C)
NetD7_2: D7.2 R37.2
NetJ8_5: J8.5 U9.8(OUT) ; port PIRDETECT
NetQ6_1: Q6.1(B) R36.2
NetR24_2: R24.2 RT1.1 U8.3
NetR29_1: R29.1 U8.1 U8.4
NetR32_2: R32.2 U9.10(LED_EN)
NetR33_2: R33.2 U9.12(MODE)

Not connected (* = marked no-connect by the designer): J8 6; U9 11(NC)*

### Notes on the sheet
- TEMPERATURE SENSOR AND FILTER

### Library data of the parts
C39 C44 C45 = CAP CER 4.7uF 0805: as C5 on sheet Power Management; Supplier 1: Arrow Electronics; RoHS: Yes; Category: Ceramic Capacitors; Stock 1: 906000; Pricing 1: 2000=0.0173, 4000=0.0169, 10000=0.0146, 14000=0.0133, 50000=0.0114, 100000=0.0096, 200000=0.0089 (USD); ComponentLink1URL: https://datasheet.ciiva.com/25798/cl21a475kaqnnne-25798882.pdf?src-supplier=Digi-Key; ComponentLink1Description: https://datasheet.ciiva.com/25798/cl21a475kaqnnne-25798882.pdf?src-supplier=Digi-Key; Supplier Part Number 1: CL21A475KAQNNNE
R32 R33 = RES 0 OHM 0603: Res Metal Strip 0603 0 Ohm Sulfur Resistant Pad SMD Automotive T/R; Manufacturer: Vishay Dale; Manufacturer Part Number: WSL060300000ZEA9; Temperature Coefficient: 3900ppm/°C; Supplier 1: Mouser; RoHS: Yes; Category: Chip SMD Resistors; Stock 1: 50899; Pricing 1: 1=1.09, 10=0.846, 50=0.846, 100=0.699, 1000=0.433, 10000=0.402 (USD); Case/Package: 0603; Case Code (Imperial): 0603; Case Code (Metric): 1608; Contact Plating: Tin,Matte; Min Operating Temperature: -65°C; Max Operating Temperature: 170°C; Packaging: Cut Tape; Series: WSL; Number of Terminations: 2; RoHS Compliant: Yes; ComponentLink1URL: http://www.mouser.com/ds/2/427/wsl-101914.pdf?src-supplier=Mouser; ComponentLink1Description: http://www.mouser.com/ds/2/427/wsl-101914.pdf?src-supplier=Mouser; ComponentLink2URL: http://www.vishay.com/docs/30100/wsl.pdf?src-supplier=Avnet; ComponentLink2Description: http://www.vishay.com/docs/30100/wsl.pdf?src-supplier=Avnet; ComponentLink3URL: http://www.vishay.com/docs/30192/wsl-9.pdf?src-supplier=Digi-Key; ComponentLink3Description: http://www.vishay.com/docs/30192/wsl-9.pdf?src-supplier=Digi-Key; Supplier Part Number 1: 71-WSL060300000ZEA9
RT1 = TFPT 1206L 1002FM: Thermistor PTC 10K Ohm 1% 2-Pin 1206 Surface Mount Solder Pad T/R Automotive; Manufacturer: Vishay Dale; Resistance: 10kR; Power Rating: 125mW; Voltage: 40V; Supplier 1: Mouser; Manufacturer Part Number: TFPT1206L1002FM; RoHS: Yes; Category: Thermistors; Stock 1: 7122; Pricing 1: 1=1.34, 10=1.05, 50=1.05, 100=0.714, 1000=0.53, 10000=0.453 (USD); Mount: Surface Mount; Case/Package: 1206; Case Code (Imperial): 1206; Min Operating Temperature: -55°C; Max Operating Temperature: 125°C; Packaging: Tape and Reel; Package Quantity: 5000; Tolerance: 1%; Max Power Dissipation: 125mW; Termination: SMD/SMT; Series: TFPT; Resistance Tolerance: 1%; Length: 3.2mm; Width: 1.6mm; Height: 0.55mm; Lead Free: Lead Free; RoHS Compliant: Yes; ComponentLink1URL: https://datasheet.ciiva.com/2852/tfpt-2852076.pdf?src-supplier=Digi-Key; ComponentLink1Description: https://datasheet.ciiva.com/2852/tfpt-2852076.pdf?src-supplier=Digi-Key; Supplier Part Number 1: 71-TFPT1206L1002FM
S1 = LHI 878/3902: MAX Supply Voltage: 12; MIN Supply Voltage: 2
U8 = OPA314: IC OPAMP GP 3MHZ RRO SOT23-5; Manufacturer: Texas Instruments; Manufacturer Part Number: OPA314AIDBVR; Supplier 1: Digi-Key; RoHS: Yes; Category: Amplifiers - Op Amps, Buffer, Instrumentation; Stock 1: 278; Pricing 1: 1=1.19, 10=1.065, 25=1.0104, 100=0.83, 250=0.77588, 500=0.68568, 1000=0.54132 (USD); ComponentLink1URL: https://datasheet.ciiva.com/14456/opa2314-14456281.pdf?src-supplier=Avnet; ComponentLink1Description: https://datasheet.ciiva.com/14456/opa2314-14456281.pdf?src-supplier=Avnet; ComponentLink2URL: https://datasheet.ciiva.com/14462/opa2314-14462006.pdf?src-supplier=Avnet; ComponentLink2Description: https://datasheet.ciiva.com/14462/opa2314-14462006.pdf?src-supplier=Avnet; ComponentLink3URL: https://datasheet.ciiva.com/29638/opa314-29638827.pdf?src-supplier=Digi-Key; ComponentLink3Description: https://datasheet.ciiva.com/29638/opa314-29638827.pdf?src-supplier=Digi-Key; Supplier Part Number 1: 296-36699-1-ND
U9 = NCS360000: NCS36000 Series Single 5.5V Passive Infrared Detector Controller (PIR) - SOIC-14; Manufacturer: ON Semiconductor; Manufacturer Part Number: NCS36000DG; Supplier 1: Avnet; RoHS: Yes; Category: Amplifiers - Op Amps, Buffer, Instrumentation; Stock 1: 1785; Pricing 1: 55=0.582, 60=0.56648, 120=0.55096, 280=0.53544, 550=0.51992 (USD); ComponentLink1URL: https://datasheet.ciiva.com/25629/0900766b810de37b-25629154.pdf?src-supplier=Rs; ComponentLink1Description: https://datasheet.ciiva.com/25629/0900766b810de37b-25629154.pdf?src-supplier=Rs; ComponentLink2URL: https://datasheet.ciiva.com/2965/ncs36000-d-2965211.pdf?src-supplier=Avnet; ComponentLink2Description: https://datasheet.ciiva.com/2965/ncs36000-d-2965211.pdf?src-supplier=Avnet; ComponentLink3URL: https://datasheet.ciiva.com/1782/ncs36000-d-1782043.pdf?src-supplier=Digi-Key; ComponentLink3Description: https://datasheet.ciiva.com/1782/ncs36000-d-1782043.pdf?src-supplier=Digi-Key; Supplier Part Number 1: NCS36000DG
C35 C37 C38 C41 C43 = CAP CER 100nF 0603: Case/Package: 0603

## Nets that join several sheets
3V3DC: Power Management (8 pins), Microcontroller (26 pins)
5VDC: Power Management (9 pins), Microcontroller (BZ1.2 C32#1.2)
GND: Power Management (28 pins), Microcontroller (32 pins)
LED_DRIVER: Power Management (J7.3), Microcontroller (U3.21)
NetJ7_5: Power Management (J7.5), Microcontroller (U3.22)
NetR2_1: Power Management (R2.1), Microcontroller (U3.41)
NetR5_1: Power Management (R5.1), Microcontroller (U3.45)
SWCLK: Power Management (J6.3), Microcontroller (U3.37)
SWDIO: Power Management (J6.2), Microcontroller (U3.34)
TDI: Power Management (J6.4), Microcontroller (U3.38)
TEMPERATURE_ADC: Power Management (J7.4), Microcontroller (U3.19)
USB_N: Power Management (Q1.2), Microcontroller (R10.2 U4.1 U4.6)
USB_P: Power Management (Q1.3), Microcontroller (R11.2 U4.3 U4.4)